# EAGLE schematic RasPi-P1-HAT-B_v20 (EAGLE 9.7.0)
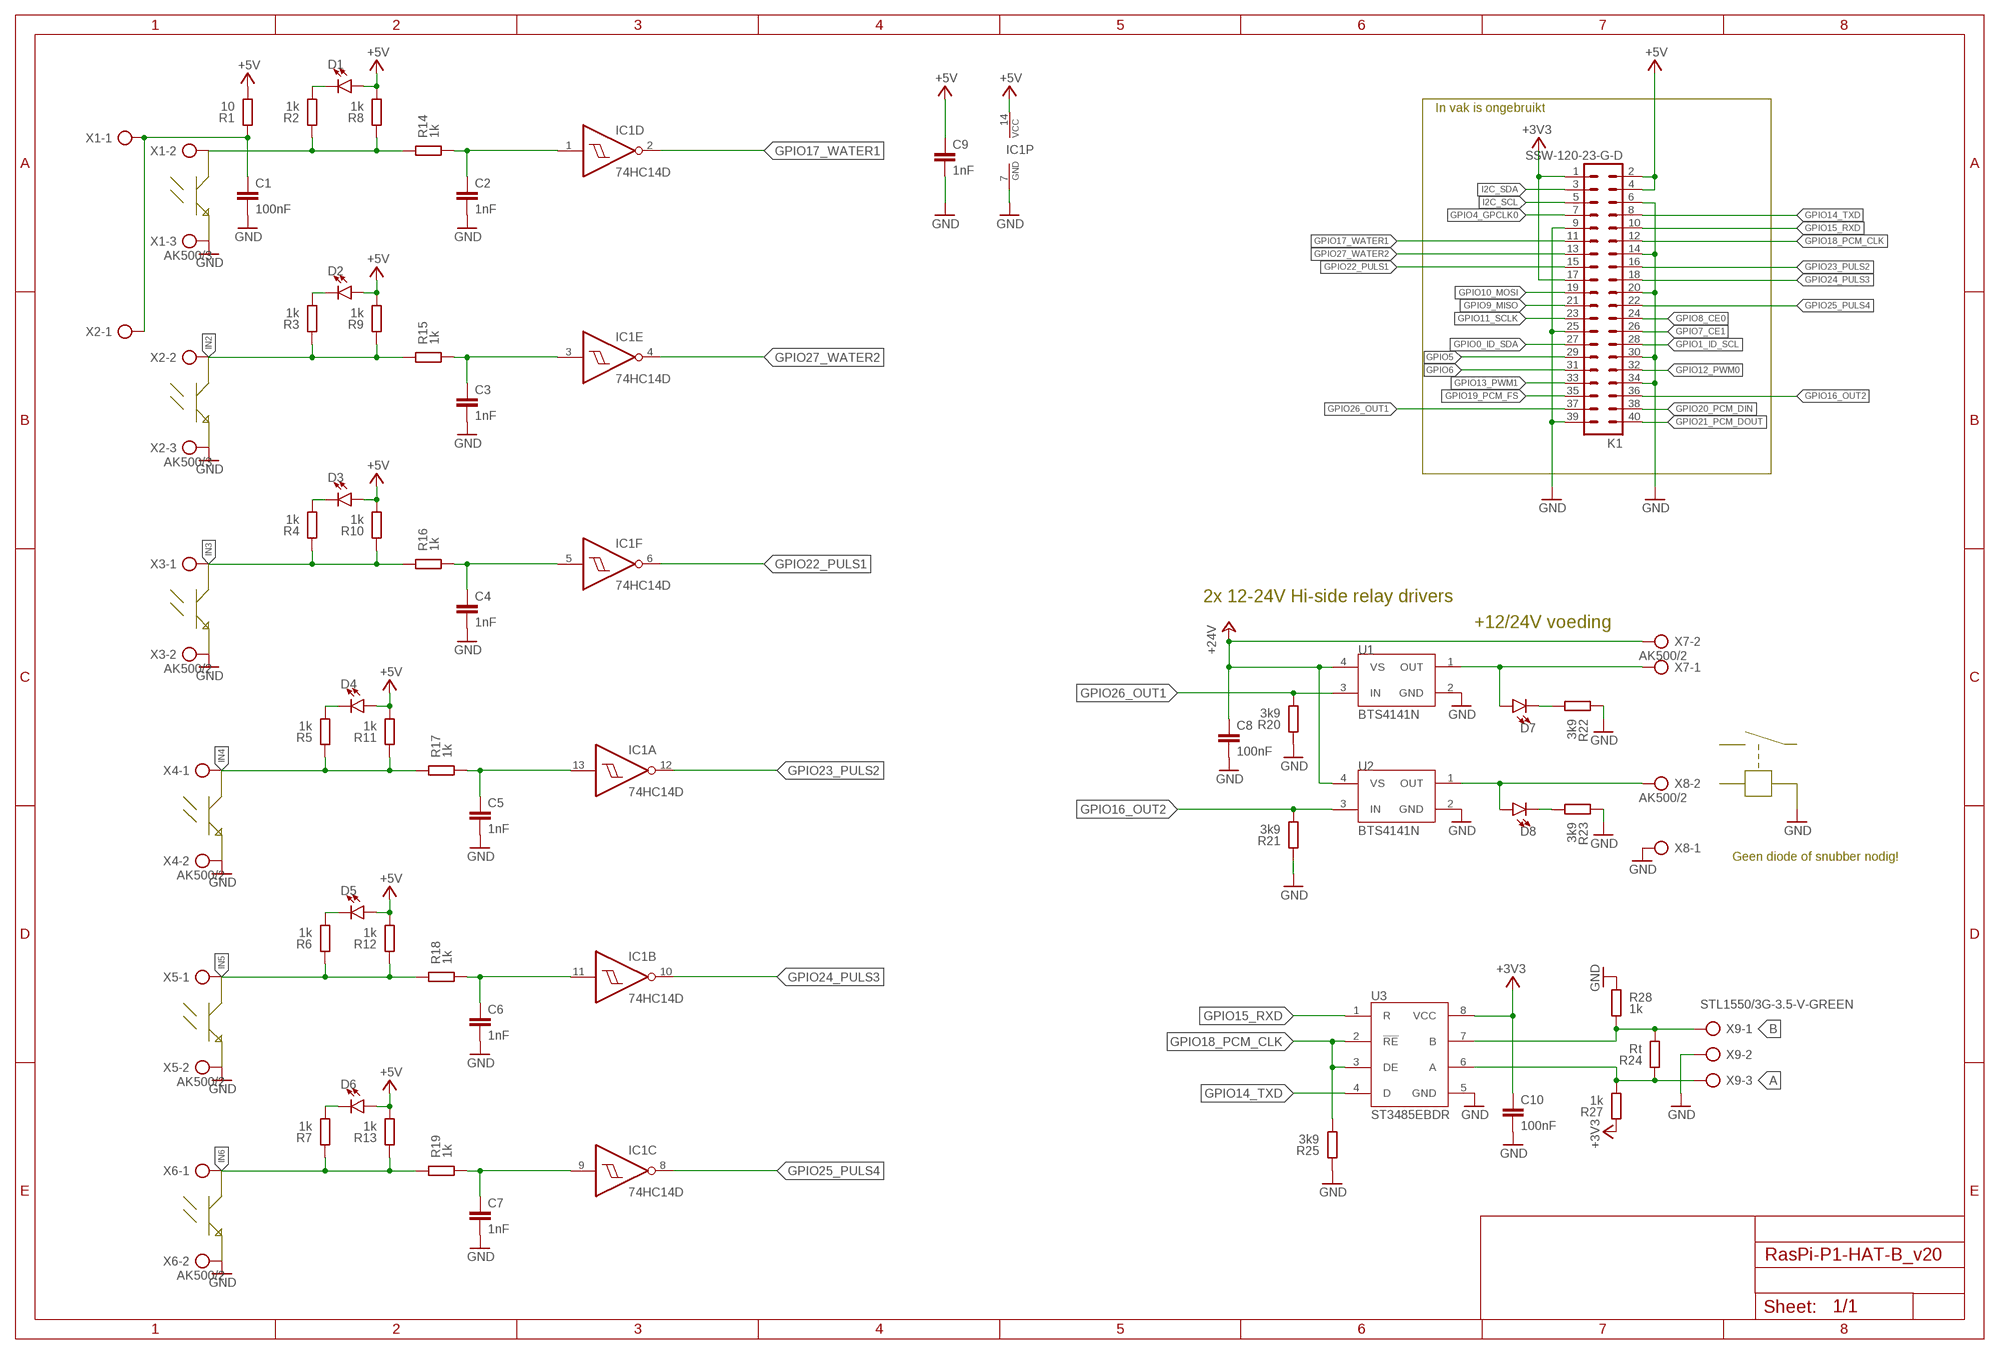
[diagram p0: schematic, sheet 1]

## Parts
C1  100nF  C-EU050-024X044  [C050-024X044]
C2  1nF  C-EU050-024X044  [C050-024X044]
C3  1nF  C-EU050-024X044  [C050-024X044]
C4  1nF  C-EU050-024X044  [C050-024X044]
C5  1nF  C-EU050-024X044  [C050-024X044]
C6  1nF  C-EU050-024X044  [C050-024X044]
C7  1nF  C-EU050-024X044  [C050-024X044]
C8  100nF  C-EU050-024X044  [C050-024X044]
C9  1nF  C-EU050-024X044  [C050-024X044]
C10  100nF  C-EU050-024X044  [C050-024X044]
D1  LED3MM  [LED_3MM]
D2  LED3MM  [LED_3MM]
D3  LED3MM  [LED_3MM]
D4  LED3MM  [LED_3MM]
D5  LED3MM  [LED_3MM]
D6  LED3MM  [LED_3MM]
D7  LED3MM  [LED_3MM]
D8  LED3MM  [LED_3MM]
IC1  74HC14D  [SO14]
K1  SSW-120-23-G-D  PIN20X2  [PIN_20X2]
R1  10  R-EU_0204/7  [0204/7]
R2  1k  R-EU_0204/7  [0204/7]
R3  1k  R-EU_0204/7  [0204/7]
R4  1k  R-EU_0204/7  [0204/7]
R5  1k  R-EU_0204/7  [0204/7]
R6  1k  R-EU_0204/7  [0204/7]
R7  1k  R-EU_0204/7  [0204/7]
R8  1k  R-EU_0204/7  [0204/7]
R9  1k  R-EU_0204/7  [0204/7]
R10  1k  R-EU_0204/7  [0204/7]
R11  1k  R-EU_0204/7  [0204/7]
R12  1k  R-EU_0204/7  [0204/7]
R13  1k  R-EU_0204/7  [0204/7]
R14  1k  R-EU_0204/7  [0204/7]
R15  1k  R-EU_0204/7  [0204/7]
R16  1k  R-EU_0204/7  [0204/7]
R17  1k  R-EU_0204/7  [0204/7]
R18  1k  R-EU_0204/7  [0204/7]
R19  1k  R-EU_0204/7  [0204/7]
R20  3k9  R-EU_0204/7  [0204/7]
R21  3k9  R-EU_0204/7  [0204/7]
R22  3k9  R-EU_0204/7  [0204/7]
R23  3k9  R-EU_0204/7  [0204/7]
R24  Rt  R-EU_0204/7  [0204/7]
R25  3k9  R-EU_0204/7  [0204/7]
R27  1k  R-EU_0204/7  [0204/7]
R28  1k  R-EU_0204/7  [0204/7]
U1  BTS4141N  BTS4141N"  [PG-SOT-223]
U2  BTS4141N  BTS4141N"  [PG-SOT-223]
U3  ST3485EBDR  SN65HVD7X  [SOIC-8]
X1  AK500/3  [AK500/3]
X2  AK500/3  [AK500/3]
X3  AK500/2  [AK500/2]
X4  AK500/2  [AK500/2]
X5  AK500/2  [AK500/2]
X6  AK500/2  [AK500/2]
X7  AK500/2  [AK500/2]
X8  AK500/2  [AK500/2]
X9  STL1550/3G-3.5-V-GREEN  [STL1550/3G-3.5-V-]

## Nets
+3V3: C10.1 K1.1 K1.17 R27.2 U3.8(VCC)
+5V: C9.1 D1.A D2.A D3.A D4.A D5.A D6.A IC1.14(P:VCC) K1.2 K1.4 R1.1 R8.1 R9.1 R10.1 R11.1 R12.1 R13.1
+24V: C8.1 U1.4(VS) U2.4(VS) X7.2
A [normal]: R24.2 R27.1 U3.6(A) X9.P$3
B [normal]: R24.1 R28.1 U3.7(B) X9.P$1
GND: C1.2 C2.2 C3.2 C4.2 C5.2 C6.2 C7.2 C8.2 C9.2 C10.2 IC1.7(P:GND) K1.6 K1.9 K1.14 K1.20 K1.25 K1.30 K1.34 K1.39 R20.2 R21.2 R22.2 R23.2 R25.2 R28.2 U1.2(GND) U2.2(GND) U3.5(GND) X1.3 X2.3 X3.2 X4.2 X5.2 X6.2 X8.1 X9.P$2
GPIO0_ID_SDA: K1.27
GPIO1_ID_SCL: K1.28
GPIO4_GPCLK0: K1.7
GPIO5: K1.29
GPIO6: K1.31
GPIO7_CE1: K1.26
GPIO8_CE0: K1.24
GPIO9_MISO: K1.21
GPIO10_MOSI: K1.19
GPIO11_SCLK: K1.23
GPIO12_PWM0: K1.32
GPIO13_PWM1: K1.33
GPIO14_TXD: K1.8 U3.4(D)
GPIO15_RXD: K1.10 U3.1(R)
GPIO16_OUT2: K1.36 R21.1 U2.3(IN)
GPIO17_WATER1: IC1.2(D:O) K1.11
GPIO18_PCM_CLK: K1.12 R25.1 U3.2(!RE) U3.3(DE)
GPIO19_PCM_FS: K1.35
GPIO20_PCM_DIN: K1.38
GPIO21_PCM_DOUT: K1.40
GPIO22_PULS1: IC1.6(F:O) K1.15
GPIO23_PULS2: IC1.12(A:O) K1.16
GPIO24_PULS3: IC1.10(B:O) K1.18
GPIO25_PULS4: IC1.8(C:O) K1.22
GPIO26_OUT1: K1.37 R20.1 U1.3(IN)
GPIO27_WATER2: IC1.4(E:O) K1.13
I2C_SCL: K1.5
I2C_SDA: K1.3
IN1: R2.2 R8.2 R14.2 X1.2
IN1_1: C2.1 IC1.1(D:I) R14.1
IN2: R3.2 R9.2 R15.2 X2.2
IN2_1: C3.1 IC1.3(E:I) R15.1
IN3: R4.2 R10.2 R16.2 X3.1
IN3_1: C4.1 IC1.5(F:I) R16.1
IN4: R5.2 R11.2 R17.2 X4.1
IN5: R6.2 R12.2 R18.2 X5.1
IN6: R7.2 R13.2 R19.2 X6.1
N$1: D6.K(C) R7.1
N$2: D5.K(C) R6.1
N$3: D4.K(C) R5.1
N$4: D7.K(C) R22.1
N$5: D8.K(C) R23.1
N$6: D3.K(C) R4.1
N$7: D2.K(C) R3.1
N$8: D1.K(C) R2.1
N$13: C5.1 IC1.13(A:I) R17.1
N$15: C6.1 IC1.11(B:I) R18.1
N$17: C7.1 IC1.9(C:I) R19.1
N$19: C1.1 R1.2 X1.1 X2.1
OUT1: D7.A U1.1(OUT) X7.1
OUT2: D8.A U2.1(OUT) X8.2

## Notes on the sheet
- In vak is ongebruikt
- 2x 12-24V Hi-side relay drivers
- +12/24V voeding
- Geen diode of snubber nodig!

## Library data of the parts
C1-C10 = Library:C-EU: CAPACITOR, European symbol; DIELECTRIC: X7R; SPICEPREFIX: C
D1-D8 = Library:LED: LED (Generic) Standard schematic elements and footprints for 5mm, 3mm, 1206, and 0603 sized LEDs. Generic LEDs with no color specified.; PROD_ID: DIO-08794
IC1 = 74xx-eu:74*14: Hex schmitt trigger INVERTER
K1 = Library:PIN20X2
R1-R25 R27 R28 = rcl:R-EU_: RESISTOR, European symbol; SPICEPREFIX: R; TOLERANCE: 5%
U1 U2 = Library:BTS4141N
U3 = Library:SN65HVD7X
X1 X2 = Library:AK500/3: CONNECTOR; OC_FARNELL: unknown; OC_NEWARK: unknown
X3-X8 = Library:AK500/2: CONNECTOR; OC_FARNELL: unknown; OC_NEWARK: unknown
X9 = Library:STL1550/3G-3.5-V-GREEN

## Net classes
0 default: width 0.3 mm, clearance 0.25 mm
1 normal: width 0.3 mm, clearance 0.25 mm
2 power: width 0.5 mm, clearance 0.25 mm